# EAGLE schematic layout2 (EAGLE 9.1.3)
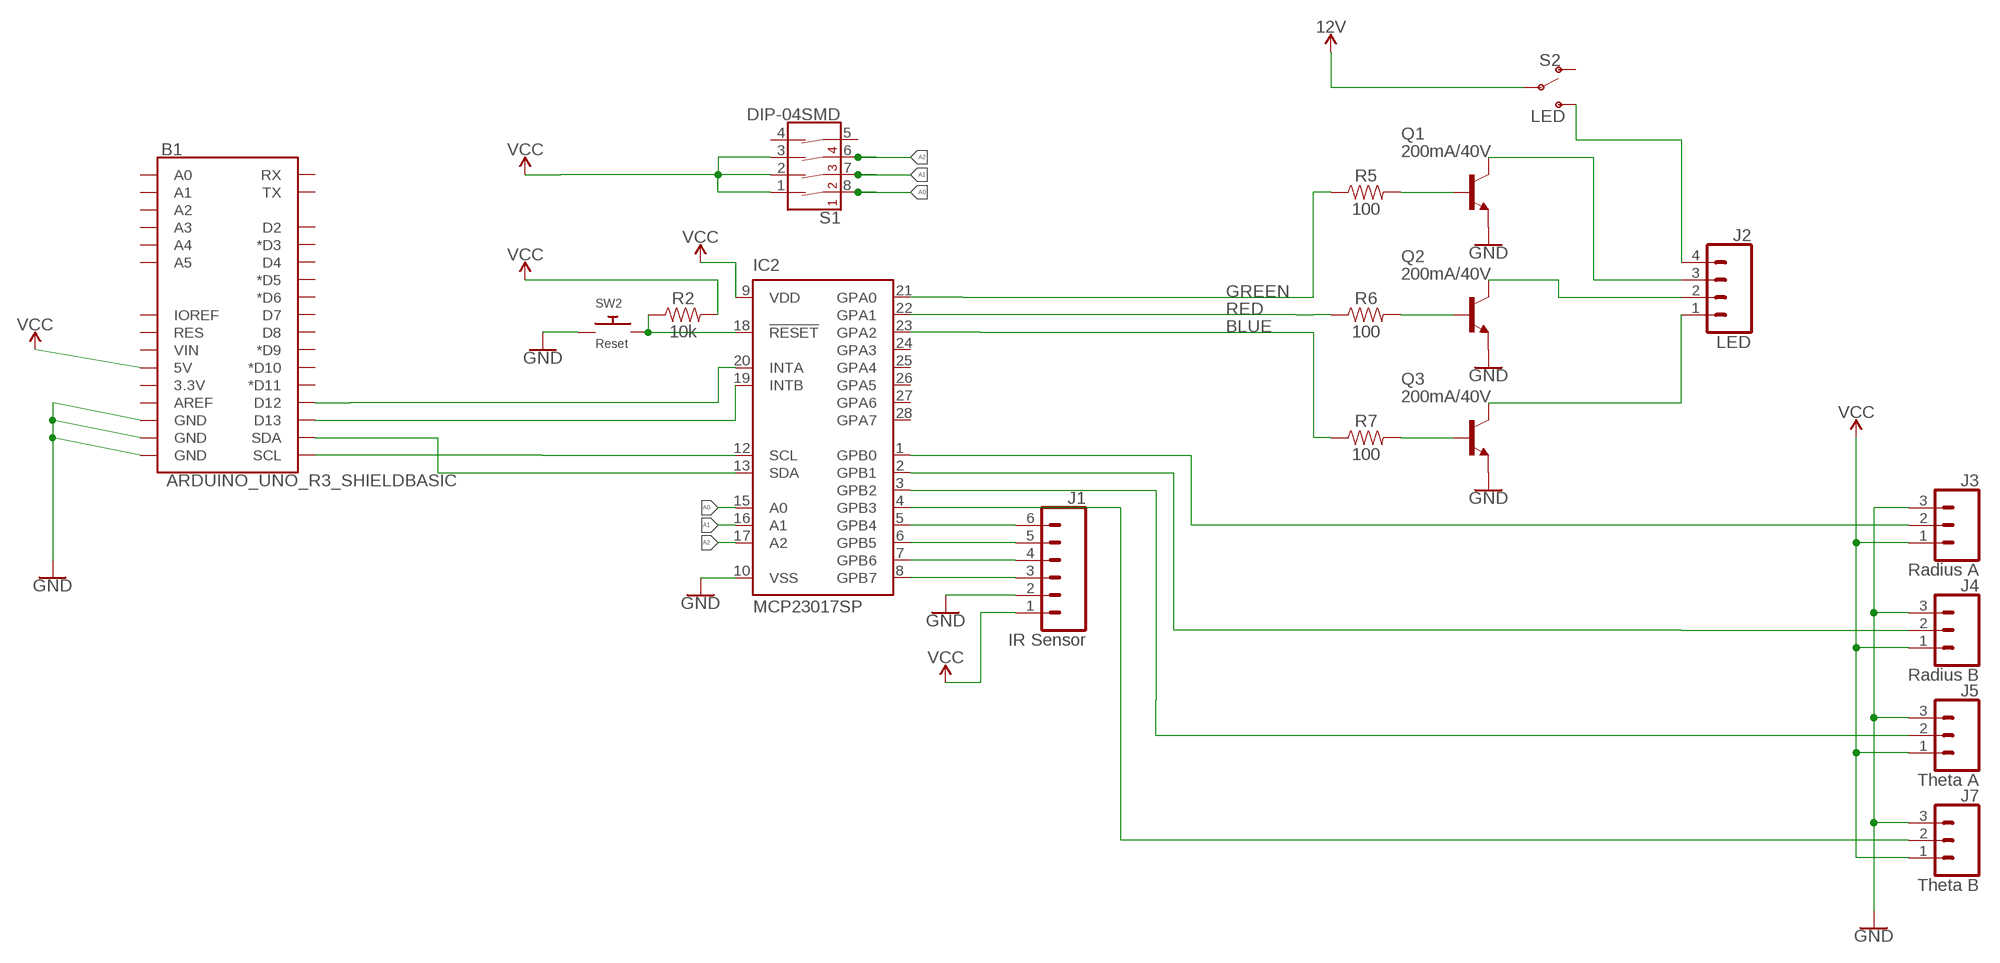
[diagram p0: schematic, sheet 1]

## Parts
B1  ARDUINO_UNO_R3_SHIELDBASIC  [UNO_R3_SHIELD]
IC2  MCP23017SP  [DIL28-3]
J1  IR Sensor  CONN_06SILK_FEMALE_PTH  [1X06]
J2  LED  CONN_04POLAR  [MOLEX-1X4]
J3  Radius A  CONN_03POLAR  [MOLEX-1X3]
J4  Radius B  CONN_03POLAR  [MOLEX-1X3]
J5  Theta A  CONN_03POLAR  [MOLEX-1X3]
J7  Theta B  CONN_03POLAR  [MOLEX-1X3]
Q1  200mA/40V  -NPN-TO220  [TO220]
Q2  200mA/40V  -NPN-TO220  [TO220]
Q3  200mA/40V  -NPN-TO220  [TO220]
R2  10k  10KOHM-0603-1/10W-1%  [0603]
R5  100  100OHM-0603-1/4W-5%  [0603]
R6  100  100OHM-0603-1/4W-5%  [0603]
R7  100  100OHM-0603-1/4W-5%  [0603]
S1  DIP-04SMD  [DIPSWITCH-04-SMD]
S2  LED  SWITCH-SPDT-PTH-11.6X4.0MM  [SWITCH_SPDT_PTH_11.6X4.0MM]
SW2  Reset  SWITCH_PUSHBUTTONC&K_KSS  [BTN_CK_KSS]

## Nets
12V: S2.2(P)
A0: IC2.15(A0) S1.8(1B)
A1: IC2.16(A1) S1.7(2B)
A2: IC2.17(A2) S1.6(3B)
BLUE: IC2.23(GPA2) R7.1
GND: B1.GND@0(GND) B1.GND@1(GND) B1.GND@2(GND) IC2.10(VSS) J1.2 J3.3 J4.3 J5.3 J7.3 Q1.3(E) Q2.3(E) Q3.3(E) SW2.P$1
GREEN: IC2.21(GPA0) R5.1
INT_A: B1.D12 IC2.20(INTA)
INT_B: B1.D13 IC2.19(INTB)
IR_A: IC2.8(GPB7) J1.3
IR_B: IC2.7(GPB6) J1.4
IR_C: IC2.6(GPB5) J1.5
IR_D: IC2.5(GPB4) J1.6
N$1: J2.4 S2.3(S)
N$2: Q1.1(B) R5.2
N$3: J2.3 Q1.2(C)
N$4: Q2.1(B) R6.2
N$5: J2.2 Q2.2(C)
N$6: Q3.1(B) R7.2
N$7: J2.1 Q3.2(C)
RADIUS_A: IC2.1(GPB0) J3.2
RADIUS_B: IC2.2(GPB1) J4.2
RED: IC2.22(GPA1) R6.1
RESET: IC2.18(!RESET) R2.1 SW2.P$2
SDA: B1.SDA IC2.13(SDA)
SDL: B1.SCL IC2.12(SCL)
THETA_A: IC2.3(GPB2) J5.2
THETA_B: IC2.4(GPB3) J7.2
VCC: B1.5V IC2.9(VDD) J1.1 J3.1 J4.1 J5.1 J7.1 R2.2 S1.1(1A) S1.2(2A) S1.3(3A)
Unconnected: B1.3.3V B1.A0 B1.A1 B1.A2 B1.A3 B1.A4 B1.A5 B1.AREF B1.D2 B1.D3(*D3) B1.D4 B1.D5(*D5) B1.D6(*D6) B1.D7 B1.D8 B1.D9(*D9) B1.D10(*D10) B1.D11(*D11) B1.IOREF B1.RES B1.RX B1.TX B1.VIN IC2.24(GPA3) IC2.25(GPA4) IC2.26(GPA5) IC2.27(GPA6) IC2.28(GPA7) S1.4(4A) S1.5(4B) S2.1(O)

## Library data of the parts
B1 = SparkFun-Boards:ARDUINO_UNO_R3_SHIELD: Arduino R3 Shield Footprint Shield form compatible with the Arduino Uno R3. SparkFun Products: MG2639 Cellular Shield <https://www.sparkfun.com/products/13120> MIDI Shield <https://www.sparkfun.com/products/12898> R3 Stackable Headers Kit <https://www.sparkfun.com/products/11417>
IC2 = adafruit:MCP23017: http://ww1.microchip.com/downloads/en/DeviceDoc/21952a.pdf Source: http://ww1.microchip.com/downloads/en/DeviceDoc/21952a.pdf
J1 = SparkFun-Connectors:CONN_06: Multi connection point. Often used as Generic Header-pin footprint for 0.1 inch spaced/style header connections On any of the 0.1 inch spaced packages, you can populate with these: Break Away Headers - Straight <https://www.sparkfun.com/products/116> (PRT-00116) Break Away Male Headers - Right Angle <https://www.sparkfun.com/products/553> (PRT-00553) Female Headers <https://www.sparkfun.com/products/115> (PRT-00115) Break Away Headers - Machine Pin <https://www.sparkfun.com/products/117> (PRT-00117) Break Away Female Headers - Swiss Machine Pin <https://www.sparkfun.com/products/743> (PRT-00743) Arduino Stackable Header - 6 Pin <https://www.sparkfun.com/products/9280> (PRT-09280) For SCREWTERMINALS and SPRING TERMINALS visit here: Screw Terimnals on SparkFun.com <https://www.sparkfun.com/search/results?term=Screw+Terminals> (5mm/3.5mm/2.54mm spacing) This device is also useful as a general connection point to wire up your design to another part of your project. Our various solder wires solder well into these plated through hole pads. Hook-Up Wire - Assortment (Stranded, 22 AWG) <https://www.sparkfun.com/products/11375> (PRT-11375) Hook-Up Wire - Assortment (Solid Core, 22 AWG) <https://www.sparkfun.com/products/11367> (PRT-11367) View the entire wire category on our website here <https://www.sparkfun.com/categories/141>; PROD_ID: CONN-08437
J2 = SparkFun-Connectors:CONN_04: Multi connection point. Often used as Generic Header-pin footprint for 0.1 inch spaced/style header connections On any of the 0.1 inch spaced packages, you can populate with these: Break Away Headers - Straight <https://www.sparkfun.com/products/116> (PRT-00116) Break Away Male Headers - Right Angle <https://www.sparkfun.com/products/553> (PRT-00553) Female Headers <https://www.sparkfun.com/products/115> (PRT-00115) Break Away Headers - Machine Pin <https://www.sparkfun.com/products/117> (PRT-00117) Break Away Female Headers - Swiss Machine Pin <https://www.sparkfun.com/products/743> (PRT-00743) For SCREWTERMINALS and SPRING TERMINALS visit here: Screw Terimnals on SparkFun.com <https://www.sparkfun.com/search/results?term=Screw+Terminals> (5mm/3.5mm/2.54mm spacing) This device is also useful as a general connection point to wire up your design to another part of your project. Our various solder wires solder well into these plated through hole pads. Hook-Up Wire - Assortment (Stranded, 22 AWG) <https://www.sparkfun.com/products/11375> (PRT-11375) Hook-Up Wire - Assortment (Solid Core, 22 AWG) <https://www.sparkfun.com/products/11367> (PRT-11367) View the entire wire category on our website here <https://www.sparkfun.com/categories/141> Special notes: Molex polarized connector foot print use with SKU : PRT-08231 with associated crimp pins and housings. 1MM SMD Version SKU: PRT-10208; PROD_ID: CONN-08186; SF_ID: PRT-08231
J3-J5 J7 = SparkFun-Connectors:CONN_03: Multi connection point. Often used as Generic Header-pin footprint for 0.1 inch spaced/style header connections On any of the 0.1 inch spaced packages, you can populate with these: Break Away Headers - Straight <https://www.sparkfun.com/products/116> (PRT-00116) Break Away Male Headers - Right Angle <https://www.sparkfun.com/products/553> (PRT-00553) Female Headers <https://www.sparkfun.com/products/115> (PRT-00115) Break Away Headers - Machine Pin <https://www.sparkfun.com/products/117> (PRT-00117) Break Away Female Headers - Swiss Machine Pin <https://www.sparkfun.com/products/743> (PRT-00743) Stackable Header - 3 Pin (Female, 0.1") <https://www.sparkfun.com/products/13875> (PRT-13875) For SCREWTERMINALS and SPRING TERMINALS visit here: Screw Terimnals on SparkFun.com <https://www.sparkfun.com/search/results?term=Screw+Terminals> (5mm/3.5mm/2.54mm spacing) This device is also useful as a general connection point to wire up your design to another part of your project. Our various solder wires solder well into these plated through hole pads. Hook-Up Wire - Assortment (Stranded, 22 AWG) <https://www.sparkfun.com/products/11375> (PRT-11375) Hook-Up Wire - Assortment (Solid Core, 22 AWG) <https://www.sparkfun.com/products/11367> (PRT-11367) View the entire wire category on our website here <https://www.sparkfun.com/categories/141> Special notes: Molex polarized connector foot print use with SKU : PRT-08232 with associated crimp pins and housings.; PROD_ID: CONN-08625; SF_ID: PRT-08096
Q1-Q3 = transistor-neu-to92:*-NPN-: NPN Transistror
R2 = SparkFun-Resistors:10KOHM: 10kΩ resistor A resistor is a passive two-terminal electrical component that implements electrical resistance as a circuit element. Resistors act to reduce current flow, and, at the same time, act to lower voltage levels within circuits. - Wikipedia; PROD_ID: RES-00824
R5-R7 = SparkFun-Resistors:100OHM: 100Ω resistor A resistor is a passive two-terminal electrical component that implements electrical resistance as a circuit element. Resistors act to reduce current flow, and, at the same time, act to lower voltage levels within circuits. - Wikipedia; PROD_ID: RES-12438
S1 = SparkFun-Switches:DIP-04: 4-Position DIP Switch 4-circuit DIP (dual inline package) switch. Commonly used to physcially set a circuit's behavior. SparkFun Products Prototype Part; PROD_ID: SWCH-12418
S2 = SparkFun-Switches:SWITCH-SPDT: Single Pole, Double Throw (SPDT) Switch Single-pole, double-throw (SPDT) switch. Variant Overview SMD-AYZ0202 Surface Mount DPDT Switch <https://www.sparkfun.com/products/597> (COM-00597) Used on e.g. LilyPad Arduino USB - ATmega32U4 Board <https://www.sparkfun.com/products/12049> PTH-11.6X4.0MM SPDT Mini Power Switch <https://www.sparkfun.com/products/102> (COM-00102) Used on e.g. SparkFun Simon Says - Through-Hole Soldering Kit <https://www.sparkfun.com/products/10547> (KIT-10547) PTH-11.6X4.0MM-KIT KIT version of SPDT Mini Power Switch - Simplifies soldering by removing tStop of switch pins - only one side can be soldered. PTH-11.6X4.0MM-LOCK LOCK version of SPDT Mini Power Switch - Offset pins hold switch in place for easier soldering. SMD-RIGHT-ANGLE Surface Mount Right Angle Switch <https://www.sparkfun.com/products/10860> (COM-10860) Used on e.g. SparkFun ESP8266 Thing <https://www.sparkfun.com/products/13231>; PROD_ID: SWCH-08261; SF_SKU: COM-00102
SW2 = adafruit:SWITCH_PUSHBUTTON: Buttons SOFTTOUCHSMD_SJ - Soft touch temporary push button (Super Junk Akihabara) Compatible with SKPMANE010 [Mouser: 688-SKPMAN] C&K_KSS = Digikey: KSS221GLFS